# EAGLE design teensy_4.1 (EAGLE 9.6.2)
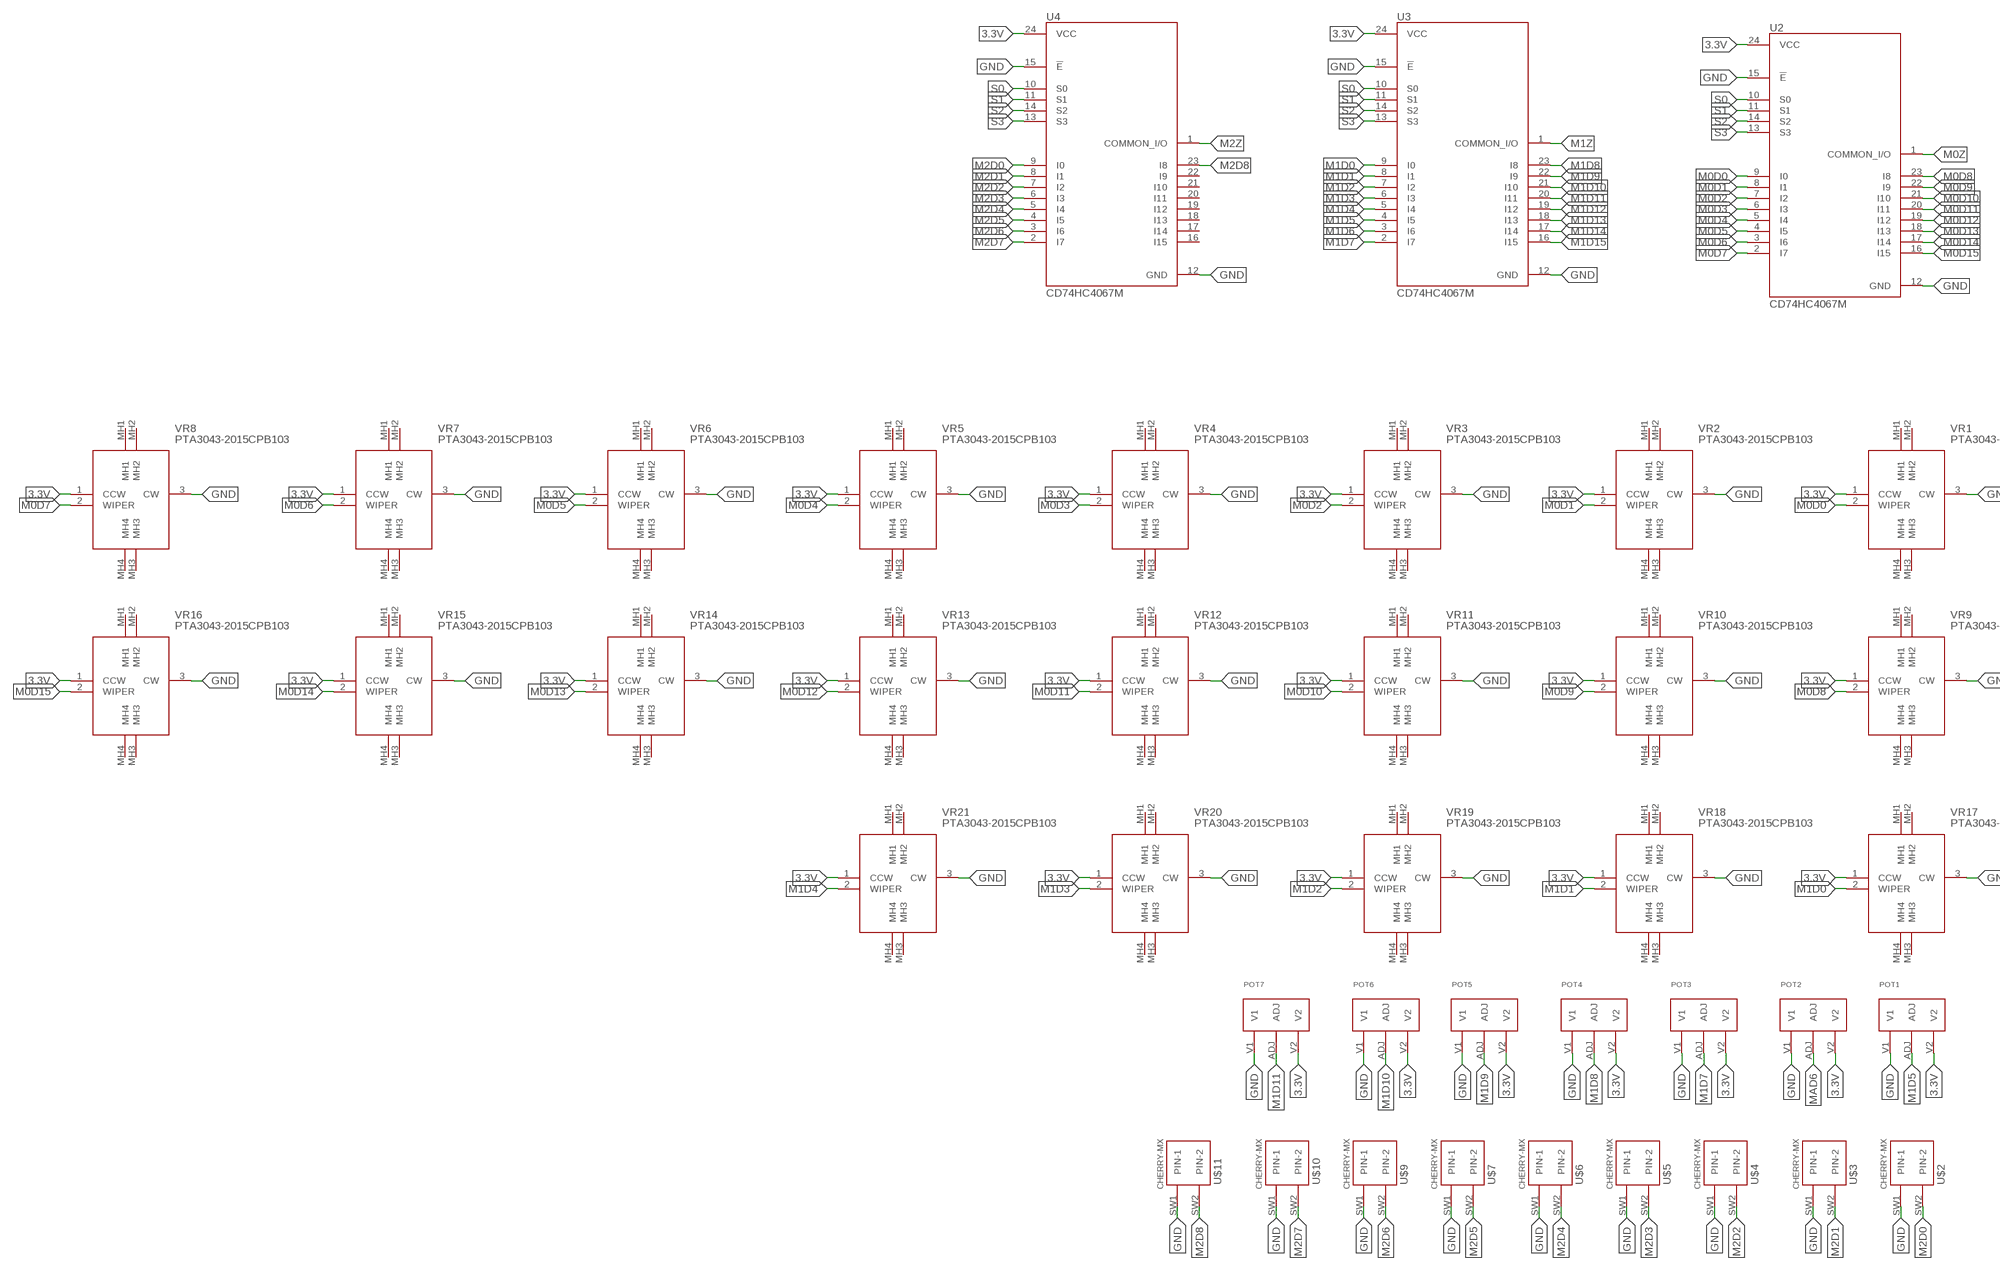
[diagram p0: schematic, sheet 1, part 1 of 2]
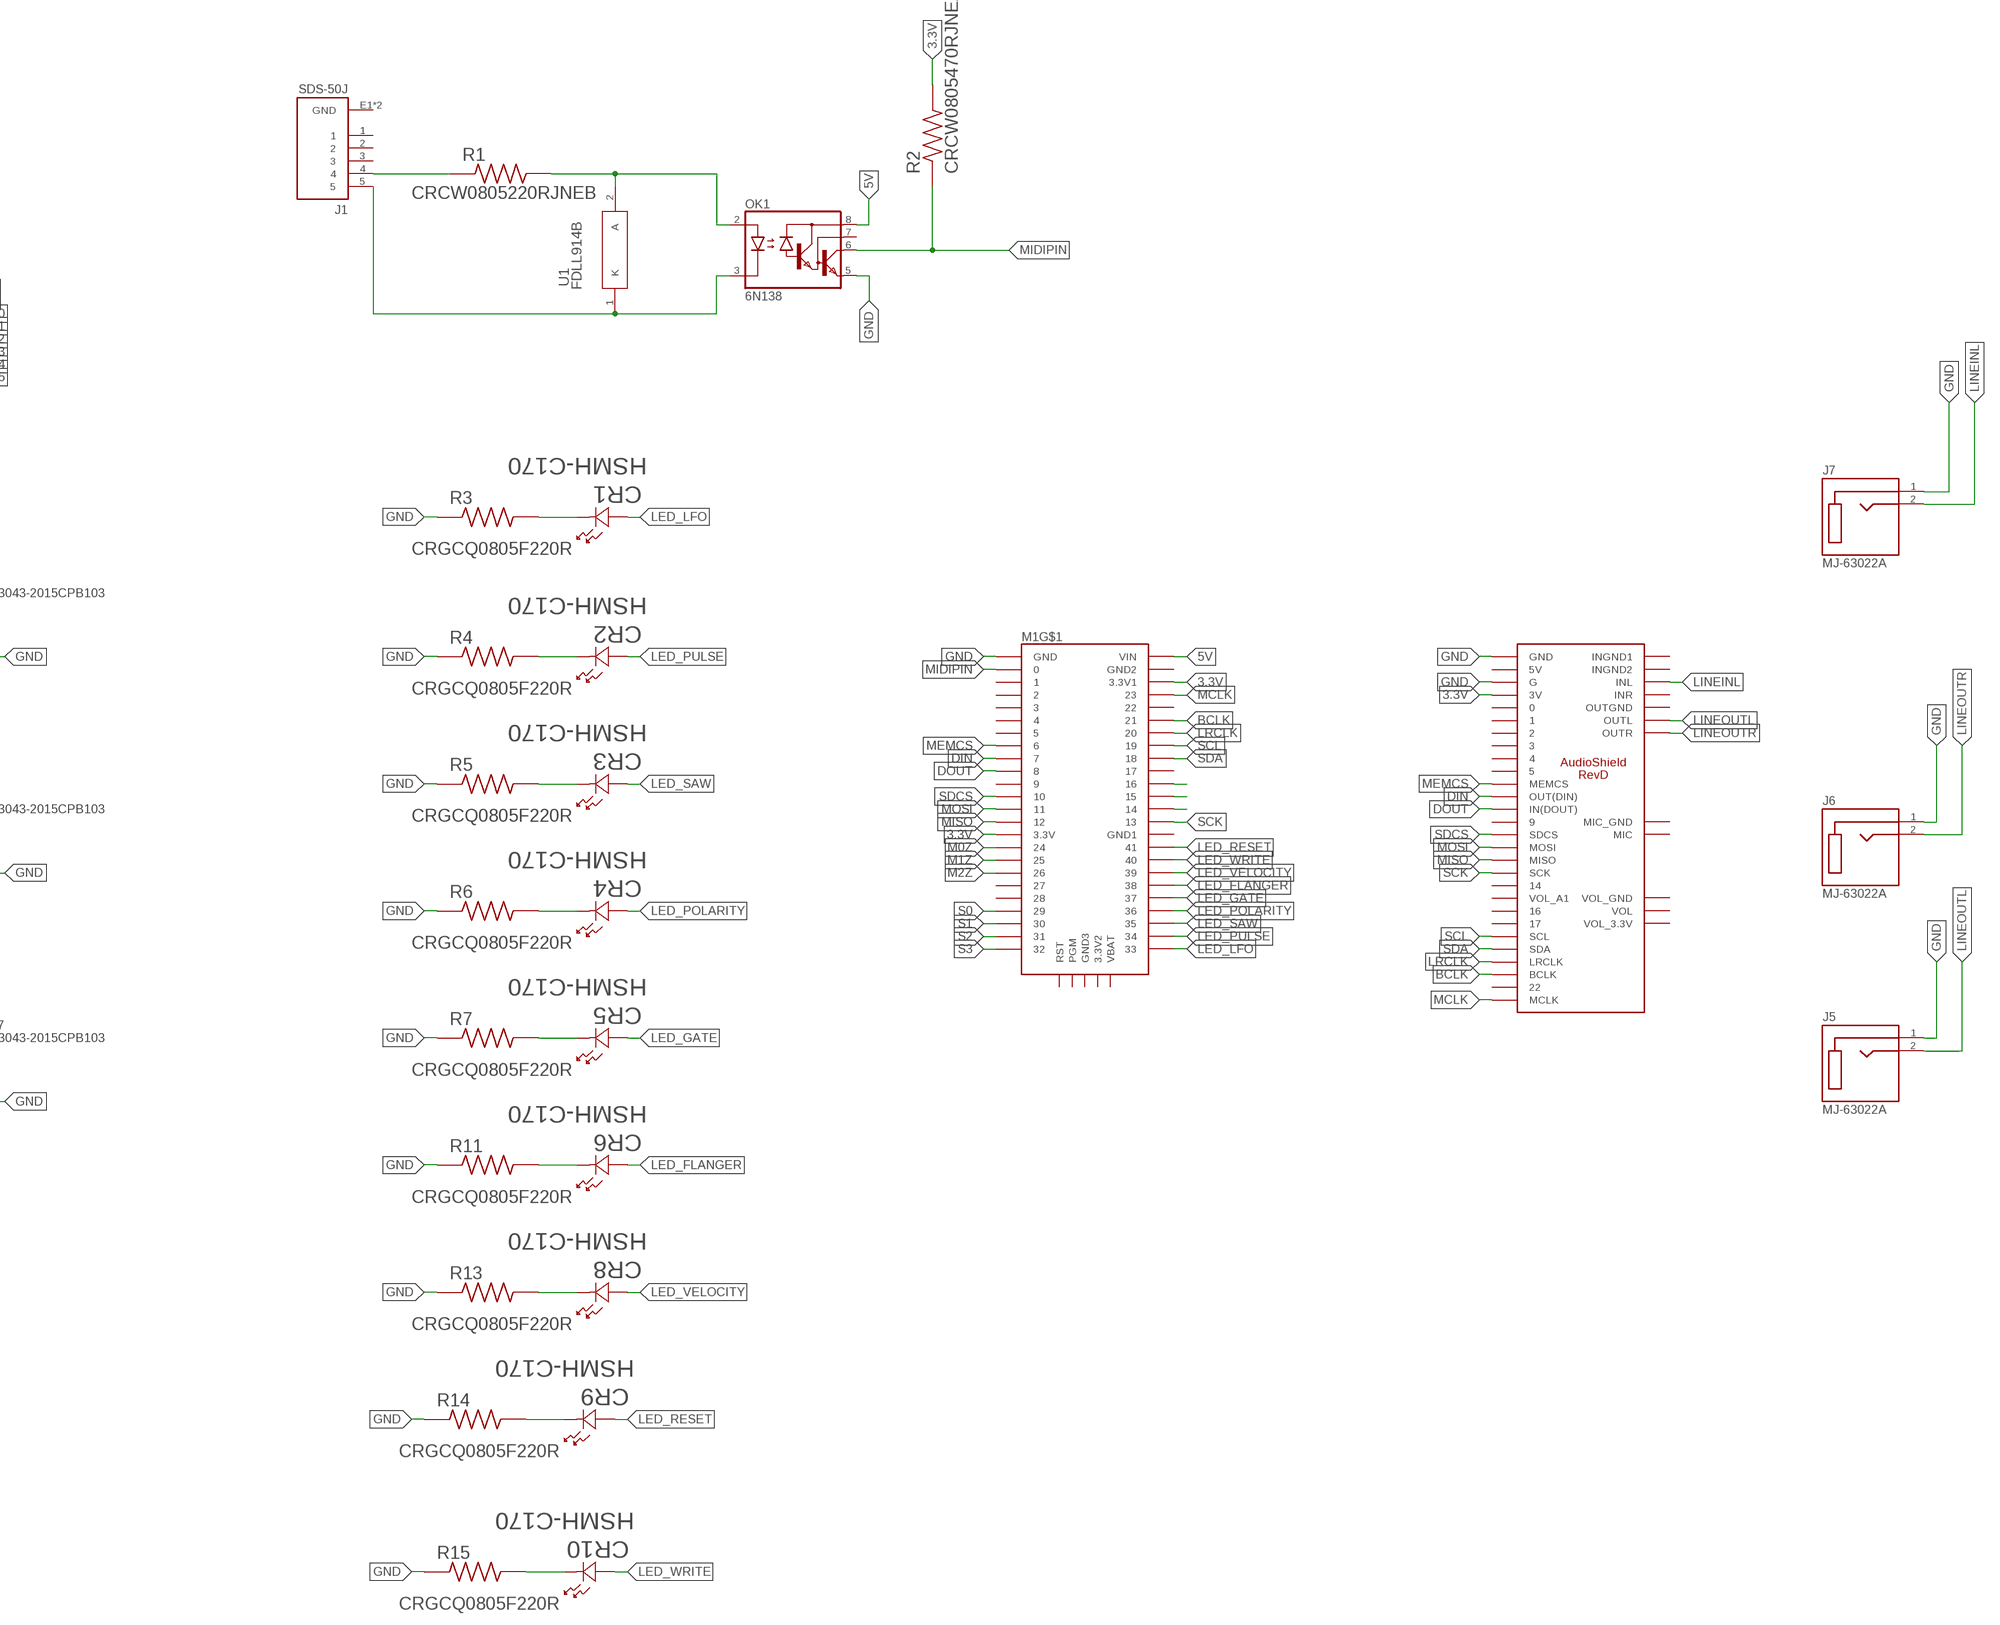
[diagram p1: schematic, sheet 1, part 2 of 2]

## Parts
CR1  HSMH-C170  [LED_HSMX-C170_AVA]
CR2  HSMH-C170  [LED_HSMX-C170_AVA]
CR3  HSMH-C170  [LED_HSMX-C170_AVA]
CR4  HSMH-C170  [LED_HSMX-C170_AVA]
CR5  HSMH-C170  [LED_HSMX-C170_AVA]
CR6  HSMH-C170  [LED_HSMX-C170_AVA]
CR8  HSMH-C170  [LED_HSMX-C170_AVA]
CR9  HSMH-C170  [LED_HSMX-C170_AVA]
CR10  HSMH-C170  [LED_HSMX-C170_AVA]
J1  SDS-50J  [CUI_SDS-50J]
J5  MJ-63022A  [CUI_MJ-63022A]
J6  MJ-63022A  [CUI_MJ-63022A]
J7  MJ-63022A  [CUI_MJ-63022A]
M1  TEENSY4.1  [TEENSY4.1]
OK1  6N138  [DIL08]
POT1  P0915N_POT  [PO915N_POT]
POT2  P0915N_POT  [PO915N_POT]
POT3  P0915N_POT  [PO915N_POT]
POT4  P0915N_POT  [PO915N_POT]
POT5  P0915N_POT  [PO915N_POT]
POT6  P0915N_POT  [PO915N_POT]
POT7  P0915N_POT  [PO915N_POT]
R1  CRCW0805220RJNEB  [RESC2012X50N]
R2  CRCW0805470RJNEA  [RESC2012X50N]
R3  CRGCQ0805F220R  [RESC2012X65N]
R4  CRGCQ0805F220R  [RESC2012X65N]
R5  CRGCQ0805F220R  [RESC2012X65N]
R6  CRGCQ0805F220R  [RESC2012X65N]
R7  CRGCQ0805F220R  [RESC2012X65N]
R11  CRGCQ0805F220R  [RESC2012X65N]
R13  CRGCQ0805F220R  [RESC2012X65N]
R14  CRGCQ0805F220R  [RESC2012X65N]
R15  CRGCQ0805F220R  [RESC2012X65N]
U1  FDLL914B  [SOD-80-2_3P6X1P5_ONS]
U2  CD74HC4067M  [SOIC127P1030X265-24N]
U3  CD74HC4067M  [SOIC127P1030X265-24N]
U4  CD74HC4067M  [SOIC127P1030X265-24N]
U$1  AUDIOSHIELD-REVD  [AUDIOSHIELD-REVD]
U$2  CHERRY-MX  [CHERRY-MX]
U$3  CHERRY-MX  [CHERRY-MX]
U$4  CHERRY-MX  [CHERRY-MX]
U$5  CHERRY-MX  [CHERRY-MX]
U$6  CHERRY-MX  [CHERRY-MX]
U$7  CHERRY-MX  [CHERRY-MX]
U$9  CHERRY-MX  [CHERRY-MX]
U$10  CHERRY-MX  [CHERRY-MX]
U$11  CHERRY-MX  [CHERRY-MX]
VR1  PTA3043-2015CPB103  [PTA30432015CPB103]
VR2  PTA3043-2015CPB103  [PTA30432015CPB103]
VR3  PTA3043-2015CPB103  [PTA30432015CPB103]
VR4  PTA3043-2015CPB103  [PTA30432015CPB103]
VR5  PTA3043-2015CPB103  [PTA30432015CPB103]
VR6  PTA3043-2015CPB103  [PTA30432015CPB103]
VR7  PTA3043-2015CPB103  [PTA30432015CPB103]
VR8  PTA3043-2015CPB103  [PTA30432015CPB103]
VR9  PTA3043-2015CPB103  [PTA30432015CPB103]
VR10  PTA3043-2015CPB103  [PTA30432015CPB103]
VR11  PTA3043-2015CPB103  [PTA30432015CPB103]
VR12  PTA3043-2015CPB103  [PTA30432015CPB103]
VR13  PTA3043-2015CPB103  [PTA30432015CPB103]
VR14  PTA3043-2015CPB103  [PTA30432015CPB103]
VR15  PTA3043-2015CPB103  [PTA30432015CPB103]
VR16  PTA3043-2015CPB103  [PTA30432015CPB103]
VR17  PTA3043-2015CPB103  [PTA30432015CPB103]
VR18  PTA3043-2015CPB103  [PTA30432015CPB103]
VR19  PTA3043-2015CPB103  [PTA30432015CPB103]
VR20  PTA3043-2015CPB103  [PTA30432015CPB103]
VR21  PTA3043-2015CPB103  [PTA30432015CPB103]

## Nets
3.3V: M1.3V3(3.3V) M1.3V3_LO(3.3V1) POT1.V2 POT2.V2 POT3.V2 POT4.V2 POT5.V2 POT6.V2 POT7.V2 R2.2 U2.24(VCC) U3.24(VCC) U4.24(VCC) U$1.3V VR1.1(CCW) VR2.1(CCW) VR3.1(CCW) VR4.1(CCW) VR5.1(CCW) VR6.1(CCW) VR7.1(CCW) VR8.1(CCW) VR9.1(CCW) VR10.1(CCW) VR11.1(CCW) VR12.1(CCW) VR13.1(CCW) VR14.1(CCW) VR15.1(CCW) VR16.1(CCW) VR17.1(CCW) VR18.1(CCW) VR19.1(CCW) VR20.1(CCW) VR21.1(CCW)
5V: M1.VIN OK1.8(VCC)
BCLK: M1.21/A7 U$1.21(BCLK)
DIN: M1.7 U$1.7(OUT(DIN))
DOUT: M1.8 U$1.8(IN(DOUT))
GND: J5.1(SLEEVE) J6.1(SLEEVE) J7.1(SLEEVE) M1.GND OK1.5(GND) POT1.V1 POT2.V1 POT3.V1 POT4.V1 POT5.V1 POT6.V1 POT7.V1 R3.1 R4.1 R5.1 R6.1 R7.1 R11.1 R13.1 R14.1 R15.1 U2.12(GND) U2.15(!E) U3.12(GND) U3.15(!E) U4.12(GND) U4.15(!E) U$1.G U$1.GND U$2.SW1(PIN-1) U$3.SW1(PIN-1) U$4.SW1(PIN-1) U$5.SW1(PIN-1) U$6.SW1(PIN-1) U$7.SW1(PIN-1) U$9.SW1(PIN-1) U$10.SW1(PIN-1) U$11.SW1(PIN-1) VR1.3(CW) VR2.3(CW) VR3.3(CW) VR4.3(CW) VR5.3(CW) VR6.3(CW) VR7.3(CW) VR8.3(CW) VR9.3(CW) VR10.3(CW) VR11.3(CW) VR12.3(CW) VR13.3(CW) VR14.3(CW) VR15.3(CW) VR16.3(CW) VR17.3(CW) VR18.3(CW) VR19.3(CW) VR20.3(CW) VR21.3(CW)
LED_FLANGER: CR6.2 M1.38
LED_GATE: CR5.2 M1.37
LED_LFO: CR1.2 M1.33
LED_POLARITY: CR4.2 M1.36
LED_PULSE: CR2.2 M1.34
LED_RESET: CR9.2 M1.41
LED_SAW: CR3.2 M1.35
LED_VELOCITY: CR8.2 M1.39
LED_WRITE: CR10.2 M1.40
LINEINL: J7.2(TIP) U$1.INL
LINEOUTL: J5.2(TIP) U$1.OUTL
LINEOUTR: J6.2(TIP) U$1.OUTR
LRCLK: M1.20/A6 U$1.20(LRCLK)
M0D0: U2.9(I0) VR1.2(WIPER)
M0D1: U2.8(I1) VR2.2(WIPER)
M0D2: U2.7(I2) VR3.2(WIPER)
M0D3: U2.6(I3) VR4.2(WIPER)
M0D4: U2.5(I4) VR5.2(WIPER)
M0D5: U2.4(I5) VR6.2(WIPER)
M0D6: U2.3(I6) VR7.2(WIPER)
M0D7: U2.2(I7) VR8.2(WIPER)
M0D8: U2.23(I8) VR9.2(WIPER)
M0D9: U2.22(I9) VR10.2(WIPER)
M0D10: U2.21(I10) VR11.2(WIPER)
M0D11: U2.20(I11) VR12.2(WIPER)
M0D12: U2.19(I12) VR13.2(WIPER)
M0D13: U2.18(I13) VR14.2(WIPER)
M0D14: U2.17(I14) VR15.2(WIPER)
M0D15: U2.16(I15) VR16.2(WIPER)
M0Z: M1.24 U2.1(COMMON_I/O)
M1D0: U3.9(I0) VR17.2(WIPER)
M1D1: U3.8(I1) VR18.2(WIPER)
M1D2: U3.7(I2) VR19.2(WIPER)
M1D3: U3.6(I3) VR20.2(WIPER)
M1D4: U3.5(I4) VR21.2(WIPER)
M1D5: POT1.ADJ U3.4(I5)
M1D6: U3.3(I6)
M1D7: POT3.ADJ U3.2(I7)
M1D8: POT4.ADJ U3.23(I8)
M1D9: POT5.ADJ U3.22(I9)
M1D10: POT6.ADJ U3.21(I10)
M1D11: POT7.ADJ U3.20(I11)
M1D12: U3.19(I12)
M1D13: U3.18(I13)
M1D14: U3.17(I14)
M1D15: U3.16(I15)
M1Z: M1.25 U3.1(COMMON_I/O)
M2D0: U4.9(I0) U$2.SW2(PIN-2)
M2D1: U4.8(I1) U$3.SW2(PIN-2)
M2D2: U4.7(I2) U$4.SW2(PIN-2)
M2D3: U4.6(I3) U$5.SW2(PIN-2)
M2D4: U4.5(I4) U$6.SW2(PIN-2)
M2D5: U4.4(I5) U$7.SW2(PIN-2)
M2D6: U4.3(I6) U$9.SW2(PIN-2)
M2D7: U4.2(I7) U$10.SW2(PIN-2)
M2D8: U4.23(I8) U$11.SW2(PIN-2)
M2Z: M1.26 U4.1(COMMON_I/O)
MAD6: POT2.ADJ
MCLK: M1.23/A9 U$1.23(MCLK)
MEMCS: M1.6 U$1.6(MEMCS)
MIDIPIN: M1.0/RX OK1.6(VO) R2.1
MISO: M1.12/MISO U$1.12(MISO)
MOSI: M1.11/MOSI U$1.11(MOSI)
N$1: M1.14/A0
N$2: M1.15/A1
N$3: M1.16/A2
N$4: J1.4 R1.1
N$5: OK1.2(A) R1.2 U1.2(A)
N$6: J1.5 OK1.3(C) U1.1(K)
N$7: CR2.1 R4.2
N$11: CR1.1 R3.2
N$16: CR3.1 R5.2
N$19: CR4.1 R6.2
N$21: CR5.1 R7.2
N$23: CR6.1 R11.2
N$27: CR8.1 R13.2
N$29: CR9.1 R14.2
N$31: CR10.1 R15.2
S0: M1.29 U2.10(S0) U3.10(S0) U4.10(S0)
S1: M1.30 U2.11(S1) U3.11(S1) U4.11(S1)
S2: M1.31/A12 U2.14(S2) U3.14(S2) U4.14(S2)
S3: M1.32 U2.13(S3) U3.13(S3) U4.13(S3)
SCK: M1.13/SCK U$1.13(SCK)
SCL: M1.19/A5/SCL U$1.19(SCL)
SDA: M1.18/A4/SDA U$1.18(SDA)
SDCS: M1.10/CS U$1.10(SDCS)
Unconnected: J1.1 J1.2 J1.3 M1.1/TX M1.2 M1.3 M1.4 M1.5 M1.9 M1.17/A3 M1.22/A8 M1.27 M1.28 M1.AGND(GND2) M1.ELED M1.ER+ M1.ER- M1.ET+(ET-) M1.ET-(ET+) M1.GND1 M1.GND2(GND3) M1.GND-E(EGND) M1.GND-U1(UGND1) M1.GND-U2(UGND2) M1.PROG(PGM) M1.RST M1.UD+(UDP) M1.UD-(UDM) M1.UVHST(U5V) M1.V33(3.3V2) M1.VBAT OK1.7(VB) U4.16(I15) U4.17(I14) U4.18(I13) U4.19(I12) U4.20(I11) U4.21(I10) U4.22(I9) U$1.0 U$1.1 U$1.2 U$1.3 U$1.4 U$1.5 U$1.5V U$1.9 U$1.14 U$1.15(VOL_A1) U$1.16 U$1.17 U$1.22 U$1.GND_MIC(MIC_GND) U$1.INGND1 U$1.INGND2 U$1.INR U$1.MIC U$1.OUTGND U$1.VOL U$1.VOL_3.3V U$1.VOL_GND VR1.MH1 VR1.MH2 VR1.MH3 VR1.MH4 VR2.MH1 VR2.MH2 VR2.MH3 VR2.MH4 VR3.MH1 VR3.MH2 VR3.MH3 VR3.MH4 VR4.MH1 VR4.MH2 VR4.MH3 VR4.MH4 VR5.MH1 VR5.MH2 VR5.MH3 VR5.MH4 VR6.MH1 VR6.MH2 VR6.MH3 VR6.MH4 VR7.MH1 VR7.MH2 VR7.MH3 VR7.MH4 VR8.MH1 VR8.MH2 VR8.MH3 VR8.MH4 VR9.MH1 VR9.MH2 VR9.MH3 VR9.MH4 VR10.MH1 VR10.MH2 VR10.MH3 VR10.MH4 VR11.MH1 VR11.MH2 VR11.MH3 VR11.MH4 VR12.MH1 VR12.MH2 VR12.MH3 VR12.MH4 VR13.MH1 VR13.MH2 VR13.MH3 VR13.MH4 VR14.MH1 VR14.MH2 VR14.MH3 VR14.MH4 VR15.MH1 VR15.MH2 VR15.MH3 VR15.MH4 VR16.MH1 VR16.MH2 VR16.MH3 VR16.MH4 VR17.MH1 VR17.MH2 VR17.MH3 VR17.MH4 VR18.MH1 VR18.MH2 VR18.MH3 VR18.MH4 VR19.MH1 VR19.MH2 VR19.MH3 VR19.MH4 VR20.MH1 VR20.MH2 VR20.MH3 VR20.MH4 VR21.MH1 VR21.MH2 VR21.MH3 VR21.MH4

## Power pins joined to a net without a drawn wire
GND: J1.E1(GND) J1.E2(GND)

## Library data of the parts
CR1-CR6 CR8-CR10 = HSMH-C170:HSMH-C170; COPYRIGHT: Copyright (C) 2021 Ultra Librarian. All rights reserved.; DIGI-KEY_PART_NUMBER_1: 516-1427-1-ND; DIGI-KEY_PART_NUMBER_2: 516-1427-2-ND; DIGI-KEY_PART_NUMBER_3: 516-1427-6-ND; MANUFACTURER_PART_NUMBER: HSMH-C170; MFR_NAME: Avago Technologies
J1 = SDS-50J:SDS-50J; CUI_PURCHASE_URL: https://www.cuidevices.com/product/interconnect/connectors/din-connectors/sds-j-series?utm_source=snapeda.com&utm_medium=referral&utm_campaign=snapedaBOM; DESCRIPTION: 3~13 Positions, Receptacle, Right Angle, Through Hole, Standard Circular DIN Connector; DIGI-KEY_PART_NUMBER: CP-2350-ND; MF: CUI Devices; MP: SDS-50J; PACKAGE: None; PURCHASE-URL: https://pricing.snapeda.com/search/part/SDS-50J/?ref=eda
J5-J7 = MJ-63022A:MJ-63022A; MANUFACTURER: CUI Devices; MAXIMUM_PACKAGE_HEIGHT: 12.50mm; PARTREV: 1.0; STANDARD: Manufacturer Recommendations
M1 = teensy4.1.dist:TEENSY4.1
OK1 = optocoupler:6N138: MOTOROLA OPTO COUPLER; MF: VISHAY/TELEFUNKEN; MPN: 6N138; OC_FARNELL: 9860150; OC_NEWARK: 35K5294
POT1-POT7 = P0915N Potentiometer:P0915N_POT
R1 = CRCW0805220RJNEB:CRCW0805220RJNEB: Res Thick Film 0805 220 Ohm 5% 1/8W ±200ppm/°C Molded SMD SMD Paper T/R; DESCRIPTION: 220 Ohms ±5% 0.125W, 1/8W Chip Resistor 0805 (2012 Metric) Automotive AEC-Q200 Thick Film; DIGI-KEY_PART_NUMBER: 541-CRCW0805220RJNEBCT-ND; MF: Vishay Dale; MP: CRCW0805220RJNEB; PACKAGE: 2012 Vishay; PURCHASE-URL: https://pricing.snapeda.com/search/part/CRCW0805220RJNEB/?ref=eda
R2 = CRCW0805470RJNEA:CRCW0805470RJNEA: Resistor; Thick Film; 470 Ohms; 0.125 W; 5%; SMT; 0805; TCR 73 ppm/DegC; Cut Tape; DESCRIPTION: 470 Ohms ±5% 0.125W, 1/8W Chip Resistor 0805 (2012 Metric) Automotive AEC-Q200 Thick Film; DIGI-KEY_PART_NUMBER: 541-470ACT-ND; MF: Vishay Dale; MP: CRCW0805470RJNEA; PACKAGE: 2012 Vishay; PURCHASE-URL: https://pricing.snapeda.com/search/part/CRCW0805470RJNEA/?ref=eda
R3-R7 R11 R13-R15 = CRGCQ0805F220R:CRGCQ0805F220R: Fixed Resistor CRGCQ 0805 220R 1% Check prices <https://pricing.snapeda.com/parts/CRGCQ0805F220R/TE%20Connectivity/view-part?ref=eda>; AVAILABILITY: In Stock; COMMENT: 1-2176341-7; DESCRIPTION: Fixed Resistor CRGCQ 0805 220R 1%; MF: TE Connectivity; MP: CRGCQ0805F220R; PACKAGE: 2012 TE Connectivity; PRICE: None; PURCHASE-URL: https://pricing.snapeda.com/search/part/CRGCQ0805F220R/?ref=eda
U1 = FDLL914B_diode:FDLL914B; COPYRIGHT: Copyright (C) 2021 Ultra Librarian. All rights reserved.; DIGI-KEY_PART_NUMBER_1: FDLL914BTR-ND; DIGI-KEY_PART_NUMBER_2: FDLL914BCT-ND; DIGI-KEY_PART_NUMBER_3: FDLL914BDKR-ND; MANUFACTURER_PART_NUMBER: FDLL914B; MFR_NAME: ON Semiconductor
U2-U4 = CD74HC4067M:CD74HC4067M: 5-V, 16:1, 1-channel analog multiplexer; DESCRIPTION: 5-V, 16:1, 1-channel analog multiplexer 24-SOIC -55 to 125; DIGI-KEY_PART_NUMBER: 296-29408-2-ND; MF: Texas Instruments; MP: CD74HC4067M; PACKAGE: SOIC-24 Texas Instruments; PURCHASE-URL: https://pricing.snapeda.com/search/part/CD74HC4067M/?ref=eda
U$1 = Teensy_Audioshield:AUDIOSHIELD-REVD
U$2-U$7 U$9-U$11 = cherrymx:CHERRY-MX: Cherry MX series keyswitch
VR1-VR21 = PTA3043-2015CPB103:PTA3043-2015CPB103: Slide Potentiometers 15mm Shaft 10K Ohms Sgl Gang Met Lev Lin Source: Datasheet <https://www.bourns.com/docs/Product-Datasheets/pta.pdf>; ARROW_PART_NUMBER: PTA3043-2015CPB103; ARROW_PRICE-STOCK: https://www.arrow.com/en/products/pta3043-2015cpb103/bourns; DESCRIPTION: Slide Potentiometers 15mm Shaft 10K Ohms Sgl Gang Met Lev Lin; HEIGHT: 21.5mm; MANUFACTURER_NAME: Bourns; MANUFACTURER_PART_NUMBER: PTA3043-2015CPB103; MOUSER_PART_NUMBER: 652-PTA30432015CPB10; MOUSER_PRICE-STOCK: https://www.mouser.com/Search/Refine.aspx?Keyword=652-PTA30432015CPB10

## Board
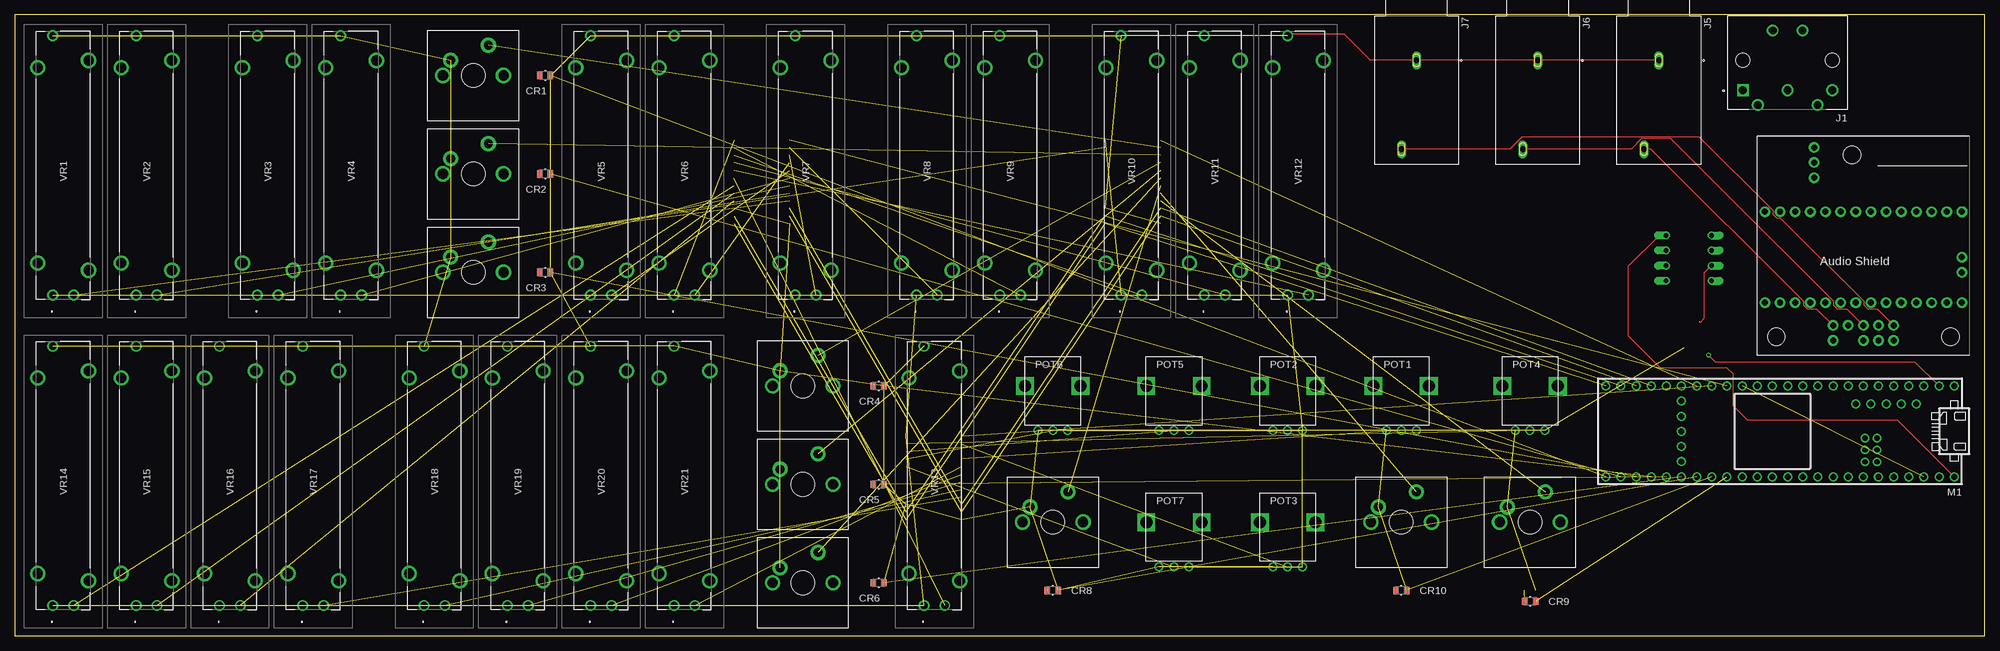
[diagram p2: board, top side]
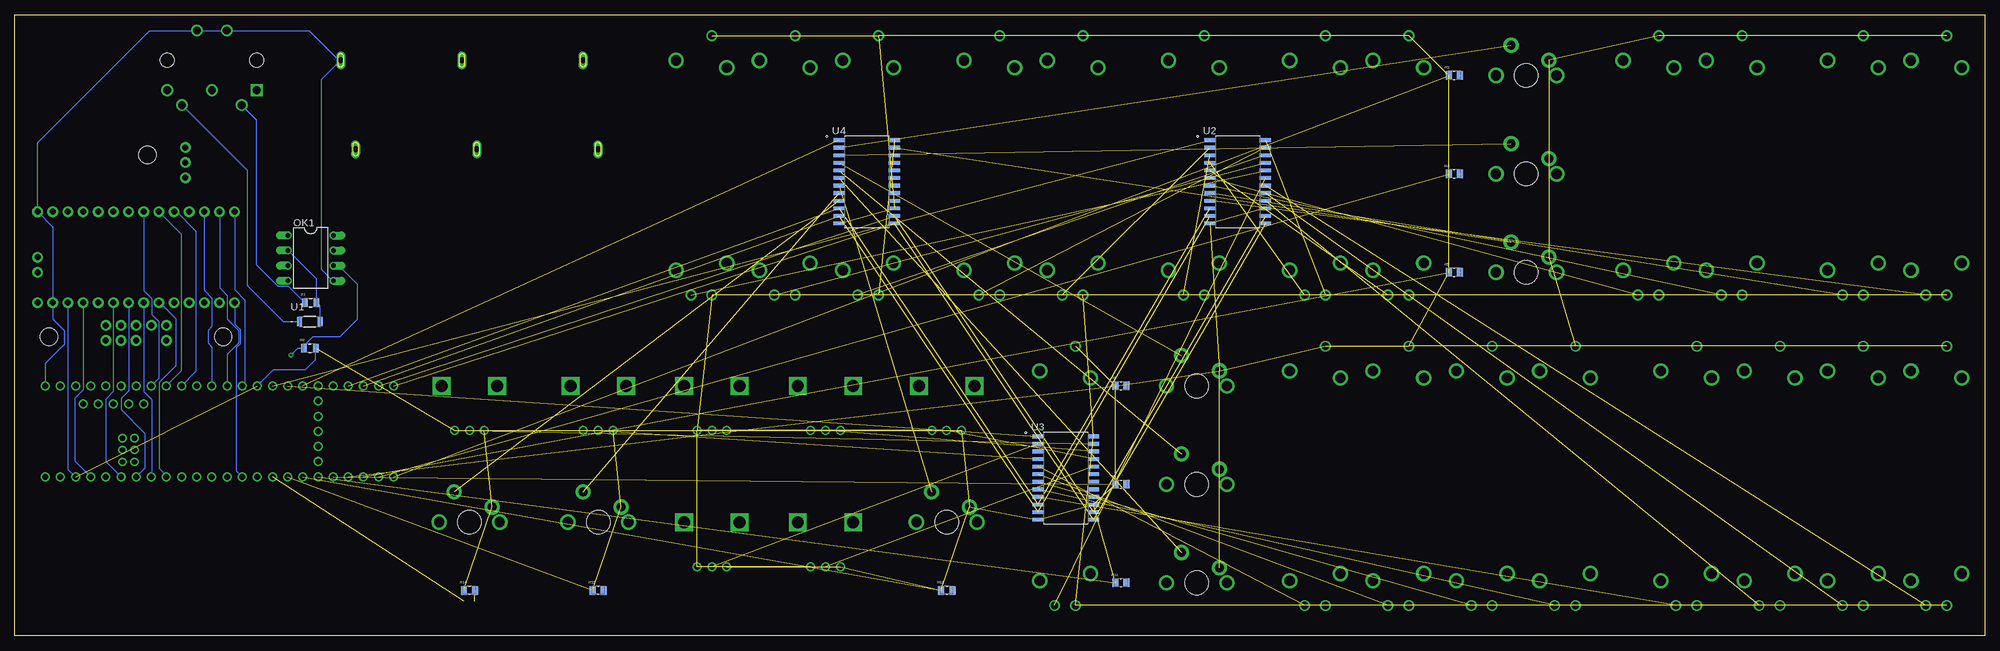
[diagram p3: board, bottom side, seen from below]

Size 330.2 x 104.14 mm. Coordinates in mm from the lower left corner, seen from the top.
Outline: 0,0 330.2,0 330.2,104.14 0,104.14 0,0
Copper layers (1*16): Top 0.035mm / dielectric 1.5mm / Bottom 0.035mm
Design rules "default": minimum track width 6mil, minimum drill 0.35mm, track to track 6mil, track to pad 6mil, pad to pad 6mil, via to via 6mil, smd to smd 6mil, copper to edge 40mil, drill to drill 6mil, minimum pad ring 10mil, minimum via ring 8mil, stop-mask expansion 4mil, vias tented up to drill 0mil, thermal gap 10mil

### Footprints (pad centres in the part's own frame; a part is rotated, then mirrored left to right if it is on the bottom)
LED_HSMX-C170_AVA = smd 0.914 x 1.245: 1 -0.902,0; 2 0.902,0
CUI_SDS-50J = drill 1.3 square: 1 7.5,5 | drill 1.3: 2 0,5; 3 -7.5,5; 4 5,7.5; 5 -5,7.5; E1 -2.5,-5; E2 2.5,-5 | hole 2.4: 7.5,0; -7.5,0
CUI_MJ-63022A = drill 1 long: 1 0,0; 2 14.9,-2.5
TEENSY4.1 = drill 1: 0/RX -26.67,-7.62; 1/TX -24.13,-7.62; 2 -21.59,-7.62; 3 -19.05,-7.62; 3V3 6.35,-7.62; 3V3_LO -24.13,7.62; 4 -16.51,-7.62; 5 -13.97,-7.62; 6 -11.43,-7.62; 7 -8.89,-7.62; 8 -6.35,-7.62; 9 -3.81,-7.62; 10/CS -1.27,-7.62; 11/MOSI 1.27,-7.62; 12/MISO 3.81,-7.62; 13/SCK 3.81,7.62; 14/A0 1.27,7.62; 15/A1 -1.27,7.62; 16/A2 -3.81,7.62; 17/A3 -6.35,7.62; 18/A4/SDA -8.89,7.62; 19/A5/SCL -11.43,7.62; 20/A6 -13.97,7.62; 21/A7 -16.51,7.62; 22/A8 -19.05,7.62; 23/A9 -21.59,7.62; 24 8.89,-7.62; 25 11.43,-7.62; 26 13.97,-7.62; 27 16.51,-7.62; 28 19.05,-7.62; 29 21.59,-7.62; 30 24.13,-7.62; 31/A12 26.67,-7.62; 32 29.21,-7.62; 33 29.21,7.62; 34 26.67,7.62; 35 24.13,7.62; 36 21.59,7.62; 37 19.05,7.62; 38 16.51,7.62; 39 13.97,7.62; 40 11.43,7.62; 41 8.89,7.62; AGND -26.67,7.62; GND -29.21,-7.62; GND1 6.35,7.62; GND2 16.51,0; GND-U1 -15.24,-4.62; GND-U2 -12.7,-4.62; PROG 16.51,2.54; RST 16.51,5.08; UD+ -17.78,-4.62; UD- -20.32,-4.62; UVHST -22.86,-4.62; V33 16.51,-2.54; VBAT 16.51,-5.08; VIN -29.21,7.62 | drill 0.9: ELED -16.24,3.12; ER+ -16.24,5.12; ER- -14.24,5.12; ET+ -14.24,1.12; ET- -16.24,1.12; GND-E -14.24,3.12
DIL08 = drill 0.813 offset: 1 -3.81,-3.81; 2 -1.27,-3.81; 3 1.27,-3.81; 4 3.81,-3.81; 5 3.81,3.81; 6 1.27,3.81; 7 -1.27,3.81; 8 -3.81,3.81
PO915N_POT = drill 1: ADJ 0,-7.5; V1 -2.5,-7.5; V2 2.5,-7.5 | drill 2 square: P$4 -4.65,0; P$5 4.65,0
RESC2012X50N = smd 0.92 x 1.42: 1 -1,0; 2 1,0
RESC2012X65N = smd 1 x 1.42: 1 -0.935,0; 2 0.935,0
SOD-80-2_3P6X1P5_ONS = smd 0.858 x 1.5: 1 -1.721,0; 2 1.721,0
SOIC127P1030X265-24N = smd 2.06 x 0.6: 1 -4.64,6.985; 2 -4.64,5.715; 3 -4.64,4.445; 4 -4.64,3.175; 5 -4.64,1.905; 6 -4.64,0.635; 7 -4.64,-0.635; 8 -4.64,-1.905; 9 -4.64,-3.175; 10 -4.64,-4.445; 11 -4.64,-5.715; 12 -4.64,-6.985; 13 4.64,-6.985; 14 4.64,-5.715; 15 4.64,-4.445; 16 4.64,-3.175; 17 4.64,-1.905; 18 4.64,-0.635; 19 4.64,0.635; 20 4.64,1.905; 21 4.64,3.175; 22 4.64,4.445; 23 4.64,5.715; 24 4.64,6.985
AUDIOSHIELD-REVD = drill 1 pad 1.778: 0 -13.97,-5.08; 1 -11.43,-5.08; 2 -8.89,-5.08; 3 -6.35,-5.08; 3V -11.43,10.16; 4 -3.81,-5.08; 5 -1.27,-5.08; 5V -16.51,10.16; 6 1.27,-5.08; 7 3.81,-5.08; 8 6.35,-5.08; 9 8.89,-5.08; 10 11.43,-5.08; 11 13.97,-5.08; 12 16.51,-5.08; 13 16.51,10.16; 14 13.97,10.16; 15 11.43,10.16; 16 8.89,10.16; 17 6.35,10.16; 18 3.81,10.16; 19 1.27,10.16; 20 -1.27,10.16; 21 -3.81,10.16; 22 -6.35,10.16; 23 -8.89,10.16; G -13.97,10.16; GND_MIC -16.51,2.54; INGND1 -5.08,16.51; INGND2 -2.54,16.51; INL -5.08,13.97; INR -2.54,13.97; MIC -16.51,5.08; OUTGND 2.54,13.97; OUTL 5.08,13.97; OUTR 0,13.97; UNUSED1 0,16.51; UNUSED2 5.08,16.51; VOL 8.255,-13.335; VOL_3.3V 8.255,-15.875; VOL_GND 8.255,-10.795 | drill 1 pad 1.778 octagon: GND -16.51,-5.08 | hole 2.921: 1.905,-14.605; -14.605,15.875; 14.605,15.875
CHERRY-MX = drill 1.714 pad 1.93: P$3 -5.08,0; P$4 5.08,0 | drill 1.5 pad 2.54: SW1 -3.81,2.54; SW2 2.54,5.08 | hole 4: 0,0
PTA30432015CPB103 = drill 1.2 pad 1.8: 1 0,0; 2 0,-3.5; 3 43.5,0 | drill 1.7 pad 2.55: MH1 5.35,2.5; MH2 38.15,2.5; MH3 39.35,-6; MH4 4.15,-6

### Placement (x,y rotation side)
CR1  88.9,93.98 0 top
CR2  88.9,77.47 0 top
CR3  88.9,60.96 0 top
CR4  144.78,41.91 0 top
CR5  144.78,25.4 0 top
CR6  144.78,8.89 0 top
CR8  173.99,7.62 0 top
CR9  254,5.79 0 top
CR10  232.41,7.62 0 top
J1  297.18,96.52 180 top
J5  275.59,96.52 270 top
J6  255.27,96.52 270 top
J7  234.95,96.52 270 top
M1  295.91,34.29 180 top
OK1  280.62,63.35 270 bottom
POT1  232.41,41.91 0 top
POT2  213.36,41.91 0 top
POT3  213.36,19.05 0 top
POT4  254,41.91 0 top
POT5  194.31,41.91 0 top
POT6  173.99,41.91 0 top
POT7  194.31,19.05 0 top
R1  280.62,55.88 0 bottom
R2  280.77,48.26 0 bottom
R3  88.9,93.98 0 bottom
R4  88.9,77.47 0 bottom
R5  88.9,60.96 0 bottom
R6  144.78,41.91 0 bottom
R7  144.78,25.4 0 bottom
R11  144.78,8.89 0 bottom
R13  173.99,7.62 0 bottom
R14  254,7.62 0 bottom
R15  232.41,7.62 0 bottom
U1  280.77,52.68 0 bottom
U2  125.22,76.15 0 bottom
U3  154.03,26.47 0 bottom
U4  187.4,76.15 0 bottom
U$1  309.88,66.04 180 top
U$2  254,19.05 0 top
U$3  232.41,19.05 0 top
U$4  173.99,19.05 0 top
U$5  132.08,8.89 0 top
U$6  132.08,25.4 0 top
U$7  132.08,41.91 0 top
U$9  76.83,77.47 0 top
U$10  76.83,93.98 0 top
U$11  76.83,60.96 0 top
VR1  6.35,57.15 90 top
VR2  20.32,57.15 90 top
VR3  40.64,57.15 90 top
VR4  54.61,57.15 90 top
VR5  96.52,57.15 90 top
VR6  110.49,57.15 90 top
VR7  130.81,57.15 90 top
VR8  151.13,57.15 90 top
VR9  165.1,57.15 90 top
VR10  185.42,57.15 90 top
VR11  199.39,57.15 90 top
VR12  213.36,57.15 90 top
VR13  152.4,5.08 90 top
VR14  6.35,5.08 90 top
VR15  20.32,5.08 90 top
VR16  34.29,5.08 90 top
VR17  48.26,5.08 90 top
VR18  68.58,5.08 90 top
VR19  82.55,5.08 90 top
VR20  96.52,5.08 90 top
VR21  110.49,5.08 90 top

### Tracks (layer width: path | path; a pad name or v marks a point on that pad's centre or on a via)
3.3V  (32 unrouted)
  Bottom 0.152: U$1.3V 321.31,27.94 M1.3V3_LO | M1.3V3 286.82,44.65 281.48,44.65 279.77,46.36 R2.2
5V
  Top 0.152: M1.VIN 315.67,36.12 290.47,36.12 288.04,38.56 288.04,43.89 286.97,44.96 275.84,44.96 270.51,50.29 270.51,62.03 275.64,67.16 OK1.8
BCLK
  Bottom 0.152: U$1.21 313.69,40.95 315.01,39.62 315.01,29.26 M1.21/A7
DIN
  Bottom 0.152: M1.7 302.21,44.5 302.21,67.26 U$1.7
DOUT
  Bottom 0.152: U$1.8 303.07,71.12 299.87,67.92 299.87,44.3 M1.8
GND  (51 unrouted)
  Top 0.152: J5.1 J6.1 J7.1 227.26,96.52 222.88,100.9 213.61,100.9 VR12.3
  Bottom 0.152: M1.GND 325.12,45.67 321.93,48.86 321.93,51.22 323.85,53.14 U$1.G 323.85,68.58 U$1.GND 326.39,82.73 307.61,101.52 J1.E1 J1.E2 280.89,101.52 275.74,96.37 | OK1.5 276.9,59.54 278.76,61.41 278.76,93.34 275.74,96.37 | 275.74,96.37 J5.1
LED_FLANGER  (1 unrouted)
LED_GATE  (1 unrouted)
LED_LFO  (1 unrouted)
LED_POLARITY  (1 unrouted)
LED_PULSE  (1 unrouted)
LED_RESET  (1 unrouted)
LED_SAW  (1 unrouted)
LED_VELOCITY  (1 unrouted)
LED_WRITE  (1 unrouted)
LINEINL
  Top 0.152: U$1.INL 312.27,54.76 310.69,54.76 310.03,55.42 310.03,56.04 296.07,70 295.45,70 294.79,70.66 294.79,71.28 282.41,83.66 252.67,83.66 250.63,81.62 J7.2
LINEOUTL
  Top 0.152: U$1.OUTL 302.11,54.76 300.53,54.76 299.87,55.42 299.87,56.04 274.29,81.62 J5.2
LINEOUTR
  Top 0.152: U$1.OUTR 307.19,54.76 305.61,54.76 304.95,55.42 304.95,56.04 277.63,83.36 272.68,83.36 270.95,81.62 J6.2
LRCLK
  Bottom 0.152: U$1.20 311.15,41.05 312.42,39.78 312.42,37.95 308.46,33.98 308.46,28.09 M1.20/A6
M0D0  (1 unrouted)
M0D1  (1 unrouted)
M0D2  (1 unrouted)
M0D3  (1 unrouted)
M0D4  (1 unrouted)
M0D5  (1 unrouted)
M0D6  (1 unrouted)
M0D7  (1 unrouted)
M0D8  (1 unrouted)
M0D9  (1 unrouted)
M0D10  (1 unrouted)
M0D11  (1 unrouted)
M0D12  (1 unrouted)
M0D13  (1 unrouted)
M0D14  (1 unrouted)
M0D15  (1 unrouted)
M0Z  (1 unrouted)
M1D0  (1 unrouted)
M1D1  (1 unrouted)
M1D2  (1 unrouted)
M1D3  (1 unrouted)
M1D4  (1 unrouted)
M1D5  (1 unrouted)
M1D7  (1 unrouted)
M1D8  (1 unrouted)
M1D9  (1 unrouted)
M1D10  (1 unrouted)
M1D11  (1 unrouted)
M1Z  (1 unrouted)
M2D0  (1 unrouted)
M2D1  (1 unrouted)
M2D2  (1 unrouted)
M2D3  (1 unrouted)
M2D4  (1 unrouted)
M2D5  (1 unrouted)
M2D6  (1 unrouted)
M2D7  (1 unrouted)
M2D8  (1 unrouted)
M2Z  (1 unrouted)
MCLK
  Bottom 0.152: U$1.23 318.77,41.2 320.19,39.78 320.19,29.36 M1.23/A9
MEMCS
  Bottom 0.152: U$1.6 308.61,57.91 307.24,56.54 307.24,53.85 306.07,52.69 306.07,43.18 M1.6
MIDIPIN  (via drill 0.35)
  Top 0.152: M1.0/RX 318.62,45.87 285.14,45.87 v283.92,47.09
  Bottom 0.152: v283.92,47.09 282.75,48.26 R2.1 281.77,48.63 280.19,50.22 275.71,50.22 272.85,53.08 272.85,59.03 275.89,62.08 OK1.6
MISO
  Bottom 0.152: U$1.12 293.37,58.07 291.66,56.36 291.66,42.35 M1.12/MISO
MOSI
  Bottom 0.152: U$1.11 295.91,58.38 294.64,57.1 294.64,53.14 292.72,51.22 292.72,49.11 294.64,47.19 M1.11/MOSI
N$4
  Bottom 0.152: R1.1 284.39,58.65 286.12,58.65 289.74,62.27 289.74,86.58 J1.4
N$5
  Bottom 0.152: U1.2 279.05,55.31 R1.2 279.62,59.81 OK1.2
N$6  (1 unrouted)
  Top 0.152: OK1.3 283.16,60.81 283.16,53.19 282.55,52.58
  Bottom 0.152: J1.5 291.27,78.11 291.27,58.71 285.24,52.68 U1.1
N$7  (1 unrouted)
N$11  (1 unrouted)
N$16  (1 unrouted)
N$19  (1 unrouted)
N$21  (1 unrouted)
N$23  (1 unrouted)
N$27  (1 unrouted)
N$29  (1 unrouted)
N$31  (1 unrouted)
S0  (3 unrouted)
S1  (3 unrouted)
S2  (3 unrouted)
S3  (3 unrouted)
SCK
  Bottom 0.152: U$1.13 293.37,52.3 292.42,51.35 292.42,48.98 293.08,48.32 293.08,27.65 M1.13/SCK
SCL
  Bottom 0.152: U$1.19 308.61,41 307.24,39.62 307.24,26.77 M1.19/A5/SCL
SDA
  Bottom 0.152: U$1.18 305.92,55.88 303.28,53.24 303.28,45.26 306.02,42.52 306.02,28.04 304.72,26.75 M1.18/A4/SDA
SDCS
  Bottom 0.152: U$1.10 298.45,57.96 297.18,56.69 297.18,51.87 297.83,51.22 297.83,49.11 297.18,48.46 M1.10/CS

### Text on the board
Top: VOLUME | FLANGER / PRESET | POLYPHONY | BANK | PATCH | NOTES OFF | PORTAMENTO | GROUP | VELOCITY | WRITE | RESET